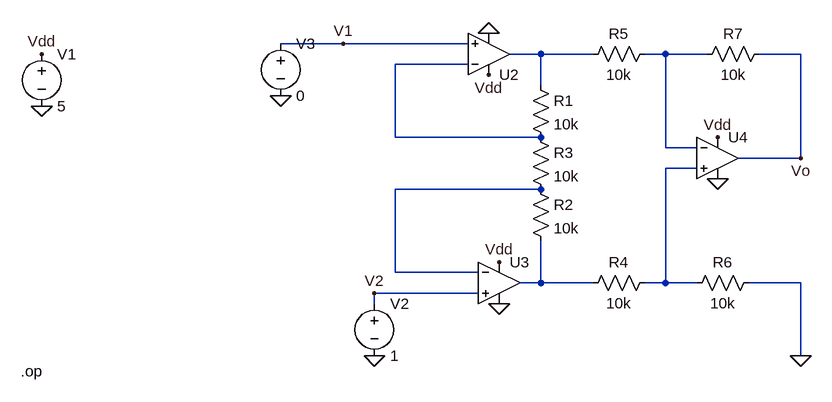
[diagram p0: schematic Draft1.asc]
Draft1.asc, the LTspice schematic file:
Version 4.1
SHEET 1 880 680
WIRE -16 0 -112 0
WIRE 176 0 -16 0
WIRE 288 16 240 16
WIRE 368 16 288 16
WIRE 480 16 448 16
WIRE 544 16 480 16
WIRE 688 16 624 16
WIRE 176 32 64 32
WIRE 288 64 288 16
WIRE 64 144 64 32
WIRE 288 144 64 144
WIRE 480 160 480 16
WIRE 528 160 480 160
WIRE 688 176 688 16
WIRE 688 176 592 176
WIRE 528 192 480 192
WIRE 288 224 64 224
WIRE 64 352 64 224
WIRE 192 352 64 352
WIRE 288 368 288 304
WIRE 288 368 256 368
WIRE 368 368 288 368
WIRE 480 368 480 192
WIRE 480 368 448 368
WIRE 528 368 480 368
WIRE 688 368 608 368
WIRE 192 384 32 384
WIRE 32 400 32 384
WIRE 688 480 688 368
FLAG -480 96 0
FLAG -480 16 Vdd
FLAG 208 48 Vdd
FLAG 224 336 Vdd
FLAG 208 -16 0
FLAG 224 400 0
FLAG 560 208 0
FLAG 560 144 Vdd
FLAG 688 176 Vo
FLAG 32 480 0
FLAG 688 480 0
FLAG -112 80 0
FLAG 32 384 V2
FLAG -16 0 V1
SYMBOL OpAmps\\UniversalOpAmp2 208 16 M180
SYMATTR InstName U2
SYMBOL OpAmps\\UniversalOpAmp2 224 368 R0
SYMATTR InstName U3
SYMBOL OpAmps\\UniversalOpAmp2 560 176 R0
SYMATTR InstName U4
SYMBOL voltage -480 0 R0
SYMATTR InstName V1
SYMATTR Value 5
SYMBOL res 272 48 R0
SYMATTR InstName R1
SYMATTR Value 10k
SYMBOL res 272 208 R0
SYMATTR InstName R2
SYMATTR Value 10k
SYMBOL voltage 32 384 R0
WINDOW 123 0 0 Left 0
WINDOW 39 0 0 Left 0
SYMATTR InstName V2
SYMATTR Value 1
SYMBOL res 272 128 R0
SYMATTR InstName R3
SYMATTR Value 10k
SYMBOL res 464 352 R90
WINDOW 0 0 56 VBottom 2
WINDOW 3 32 56 VTop 2
SYMATTR InstName R4
SYMATTR Value 10k
SYMBOL res 464 0 R90
WINDOW 0 0 56 VBottom 2
WINDOW 3 32 56 VTop 2
SYMATTR InstName R5
SYMATTR Value 10k
SYMBOL res 624 352 R90
WINDOW 0 0 56 VBottom 2
WINDOW 3 32 56 VTop 2
SYMATTR InstName R6
SYMATTR Value 10k
SYMBOL res 640 0 R90
WINDOW 0 0 56 VBottom 2
WINDOW 3 32 56 VTop 2
SYMATTR InstName R7
SYMATTR Value 10k
SYMBOL voltage -112 -16 R0
WINDOW 123 0 0 Left 0
WINDOW 39 0 0 Left 0
SYMATTR InstName V3
SYMATTR Value 0
TEXT -512 504 Left 2 !.op

The netlist it stands for:
* Draft1.asc
X§U2 V1 N003 Vdd 0 N001 level2 Avol=1Meg GBW=10Meg Slew=10Meg Ilimit=25m Rail=0 Vos=0 En=0 Enk=0 In=0 Ink=0 Rin=500Meg  ; pins In+ In- V+ V- OUT
X§U3 V2 N005 Vdd 0 N006 level2 Avol=1Meg GBW=10Meg Slew=10Meg Ilimit=25m Rail=0 Vos=0 En=0 Enk=0 In=0 Ink=0 Rin=500Meg  ; pins In+ In- V+ V- OUT
X§U4 N004 N002 Vdd 0 Vo level2 Avol=1Meg GBW=10Meg Slew=10Meg Ilimit=25m Rail=0 Vos=0 En=0 Enk=0 In=0 Ink=0 Rin=500Meg  ; pins In+ In- V+ V- OUT
V1 Vdd 0 5
R1 N001 N003 10k
R2 N005 N006 10k
V2 V2 0 1
R3 N003 N005 10k
R4 N004 N006 10k
R5 N002 N001 10k
R6 0 N004 10k
R7 Vo N002 10k
V3 V1 0 0
.op
.lib UniversalOpAmp2.lib
.backanno
.end